# EAGLE schematic 2IBWUADSEMDMB60NPRAX BOARD (EAGLE 9.6.2)
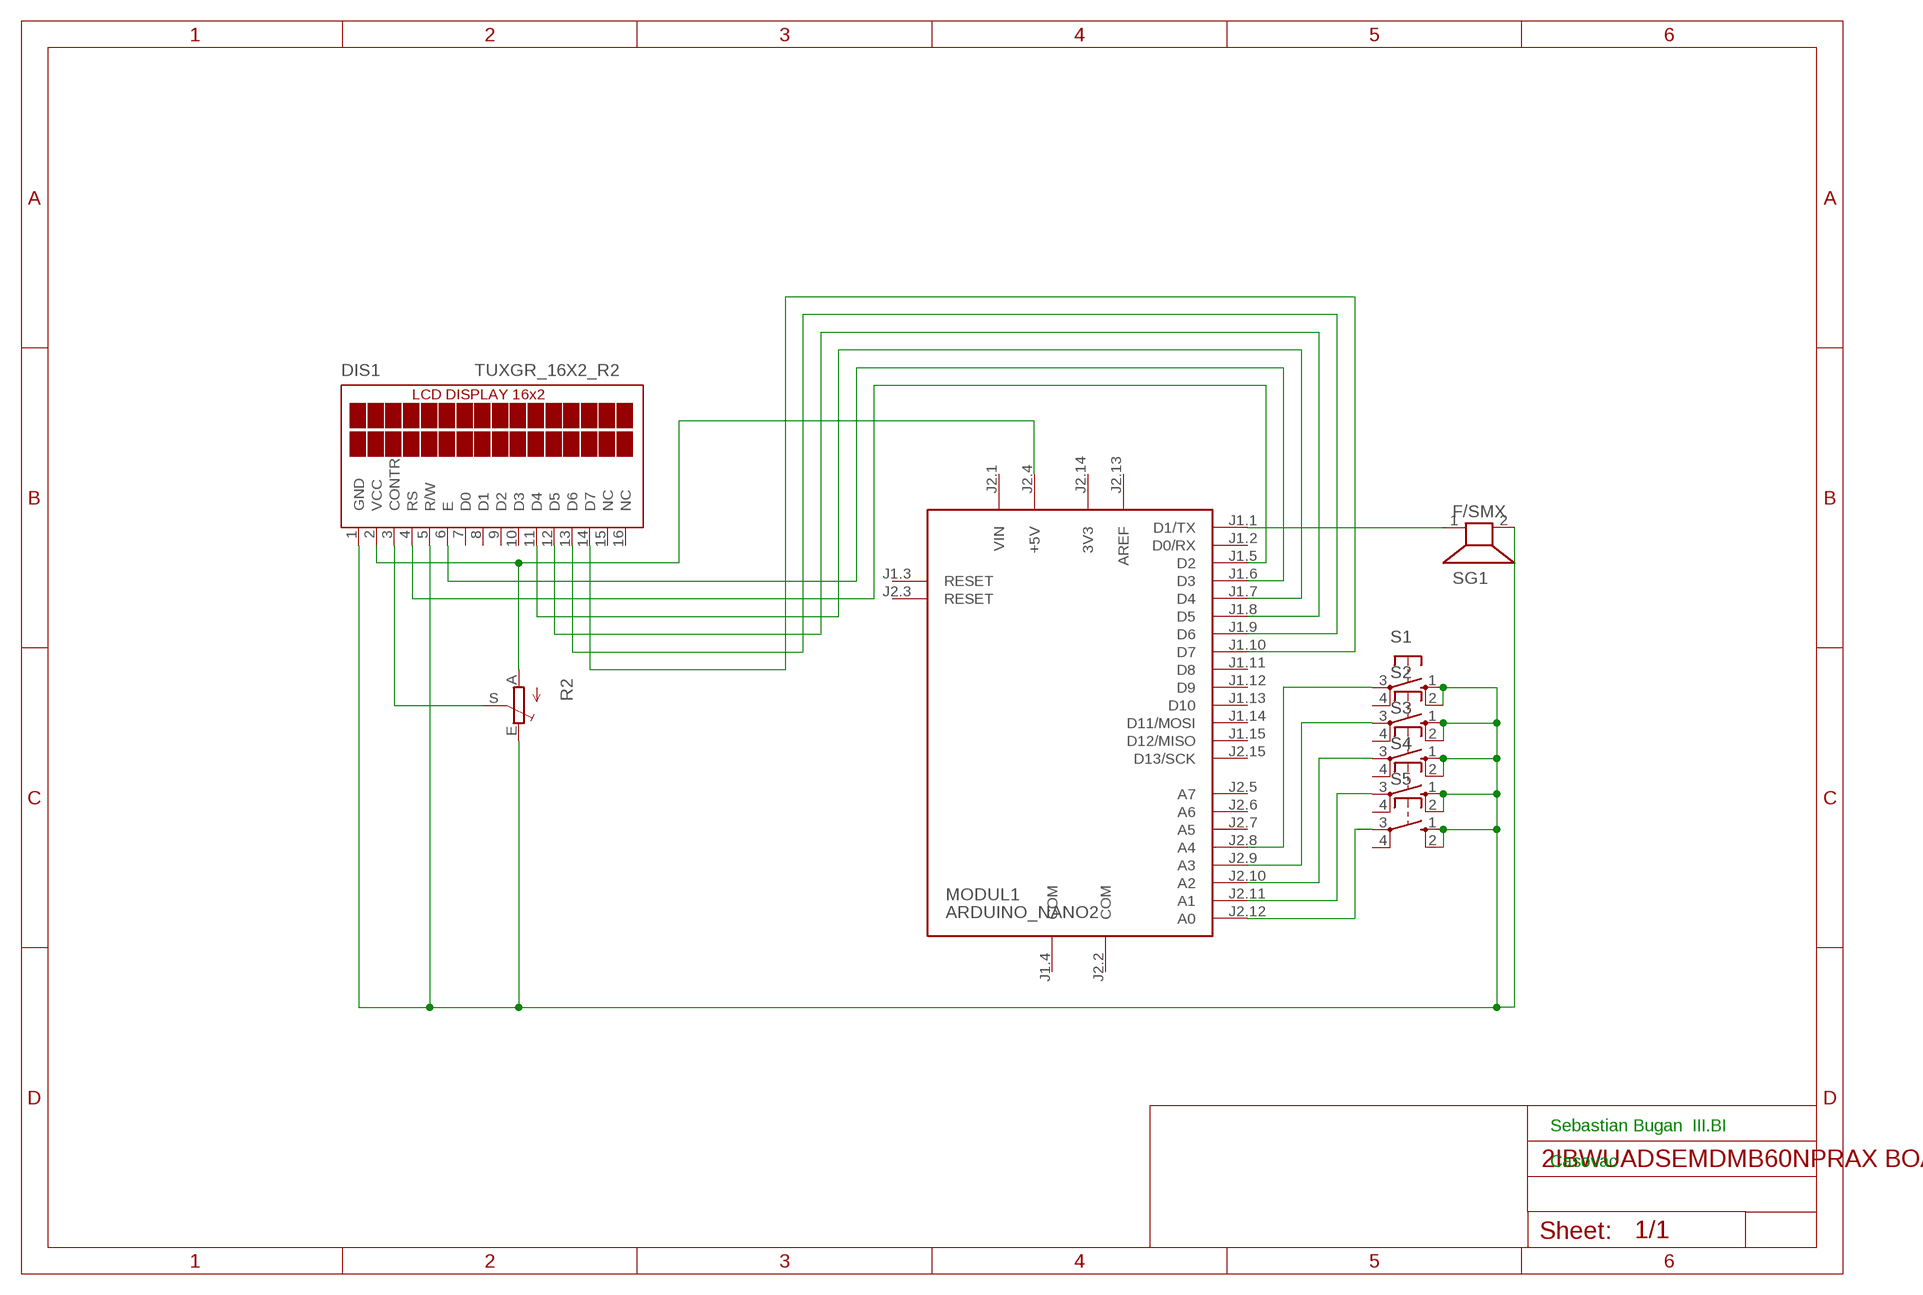
[diagram p0: schematic, sheet 1]

## Parts
DIS1  TUXGR_16X2_R2  [TUXGR_16X2_R2]
MODUL1  ARDUINO_NANO2  [ARDUINO_NANO2]
R2  TRIM_1234-S64YW  [S64YW]
S1  10-XX  [B3F-10XX]
S2  10-XX  [B3F-10XX]
S3  10-XX  [B3F-10XX]
S4  10-XX  [B3F-10XX]
S5  10-XX  [B3F-10XX]
SG1  F/SMX  [F/SMX]

## Nets
N$1: DIS1.1(GND) DIS1.5(R/W) R2.E S1.1(S) S1.2(S1) S2.1(S) S2.2(S1) S3.1(S) S3.2(S1) S4.1(S) S4.2(S1) S5.1(S) S5.2(S1) SG1.2
N$2: MODUL1.J2.12(A0) S5.3(P)
N$3: MODUL1.J2.11(A1) S4.3(P)
N$4: MODUL1.J2.10(A2) S3.3(P)
N$5: MODUL1.J2.9(A3) S2.3(P)
N$6: MODUL1.J2.8(A4) S1.3(P)
N$7: DIS1.2(VCC) MODUL1.J2.4(+5V) R2.A
N$8: DIS1.3(CONTR) R2.S
N$9: DIS1.4(RS) MODUL1.J1.5(D2)
N$10: DIS1.6(E) MODUL1.J1.6(D3)
N$11: DIS1.11(D4) MODUL1.J1.7(D4)
N$12: DIS1.12(D5) MODUL1.J1.8(D5)
N$13: DIS1.13(D6) MODUL1.J1.9(D6)
N$14: DIS1.14(D7) MODUL1.J1.10(D7)
N$15: MODUL1.J1.1(D1/TX) SG1.1
Unconnected: DIS1.7(D0) DIS1.8(D1) DIS1.9(D2) DIS1.10(D3) DIS1.15(NC) DIS1.16(NC) MODUL1.J1.2(D0/RX) MODUL1.J1.3(RESET) MODUL1.J1.11(D8) MODUL1.J1.12(D9) MODUL1.J1.13(D10) MODUL1.J1.14(D11/MOSI) MODUL1.J1.15(D12/MISO) MODUL1.J2.3(RESET) MODUL1.J2.5(A7) MODUL1.J2.6(A6) MODUL1.J2.7(A5) MODUL1.J2.15(D13/SCK) R2.S@1(S) S1.4(P1) S2.4(P1) S3.4(P1) S4.4(P1) S5.4(P1)

## Notes on the sheet
- Sebastian Bugan | III.BI
- Casovac

## Power pins joined to a net without a drawn wire
3V3: MODUL1.J2.14(3V3)
AREF: MODUL1.J2.13(AREF)
COM: MODUL1.J1.4(COM) MODUL1.J2.2(COM)
VIN: MODUL1.J2.1(VIN)

## Library data of the parts
DIS1 = display-lcd:TUXGR_16X2_R2: Tuxgraphics LCD display 16x2 characters reflective, without background light Source: tuxgr_12x2_r2.pdf; OC_FARNELL: unknown; OC_NEWARK: unknown
MODUL1 = arduino:ARDUINO_NANO2: Arduino Nano2 Auto generated by modulcreator.ulp \;; ANZAHL: 2; MODUL: TRUE; STECKX0: -76200; STECKX1: 76200; STECKY0: 177800; STECKY1: 177800
R2 = pot:TRIM_1234-: POTENTIOMETER
S1-S5 = switch-omron:10-XX: OMRON SWITCH; MPN: B3F-1000; OC_FARNELL: 176432; OC_NEWARK: 36M3542
SG1 = buzzer:F/SMX: BUZZER Source: Buerklin; OC_FARNELL: unknown; OC_NEWARK: unknown